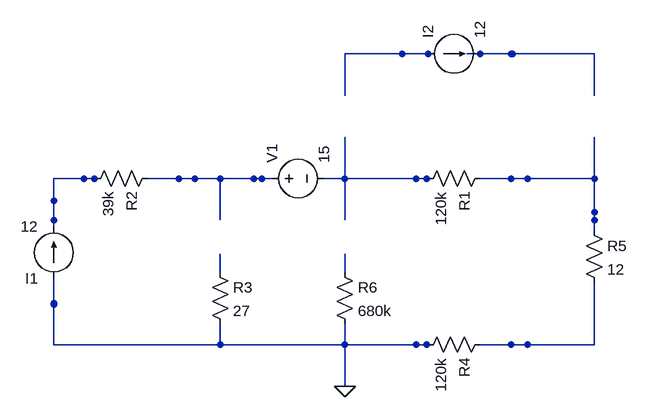
[diagram p0: schematic pannel2.asc]
pannel2.asc, the LTspice schematic file:
Version 4
SHEET 1 880 680
WIRE 208 384 281 384
WIRE 110 384 126 384
SYMBOL res 224 368 R90
SYMATTR InstName R2
SYMATTR Value 39k
WIRE 320 528 320 500
WIRE 320 640 320 608
SYMBOL res 304 512 R0
SYMATTR InstName R3
SYMATTR Value 27
WIRE 720 640 793 640
WIRE 622 640 638 640
SYMBOL res 736 624 R90
SYMATTR InstName R4
SYMATTR Value 120k
WIRE 896 464 896 436
WIRE 896 576 896 544
SYMBOL res 880 448 R0
SYMATTR InstName R5
SYMATTR Value 12
WIRE 512 528 512 500
WIRE 512 640 512 608
SYMBOL res 496 512 R0
SYMATTR InstName R6
SYMATTR Value 680k
WIRE 720 384 793 384
WIRE 622 384 638 384
SYMBOL res 736 368 R90
SYMATTR InstName R1
SYMATTR Value 120k
WIRE 64 538 64 578
WIRE 64 418 64 458
SYMBOL current 64 538 R180
SYMATTR InstName I1
SYMATTR Value 12
WIRE 640 192 600 192
WIRE 770 192 700 192
SYMBOL current 640 192 R270
SYMATTR InstName I2
SYMATTR Value 12
FLAG 512 704 0
WIRE 400 384 372 384
WIRE 512 384 480 384
SYMBOL voltage 384 384 R270
SYMATTR InstName V1
SYMATTR Value 15
WIRE 896 320 896 384
WIRE 896 384 896 448
WIRE 832 384 896 384
WIRE 896 192 896 256
WIRE 832 192 896 192
WIRE 320 640 384 640
WIRE 256 640 320 640
WIRE 896 576 896 640
WIRE 832 640 896 640
WIRE 64 576 64 640
WIRE 64 640 128 640
WIRE 64 384 64 448
WIRE 64 384 128 384
WIRE 320 384 384 384
WIRE 256 384 320 384
WIRE 320 384 320 448
WIRE 512 320 512 384
WIRE 512 384 576 384
WIRE 512 384 512 448
WIRE 512 192 512 256
WIRE 512 192 576 192
WIRE 512 640 576 640
WIRE 448 640 512 640
WIRE 512 640 512 704
WIRE 768 384 832 384
WIRE 768 640 832 640
WIRE 576 640 640 640
WIRE 384 640 448 640
WIRE 128 640 192 640
WIRE 192 640 256 640
WIRE 576 384 640 384
WIRE 576 192 640 192
WIRE 768 192 832 192

The netlist it stands for:
* pannel2.asc
R2 N001 N002 39k
R3 N003 0 27
R4 N004 0 120k
R5 N005 N004 12
R6 N006 0 680k
R1 N005 N007 120k
I1 0 N002 12
I2 N008 N009 12
V1 N001 N007 15
.backanno
.end